# Altium schematic sheet EEPROM.SchDoc: =DocumentName
size A4; CompanyName: "AS Manufacturing" LLC; Organization: "AS Manufacturing" LLC; Address1: 5 Sklyarenka St.; Address2: Kyiv 04073; Address3: Ukraine; Address4: https://ajax.systems/en/; SheetNumber: 3; SheetTotal: 5; Template_version: 1.0.1
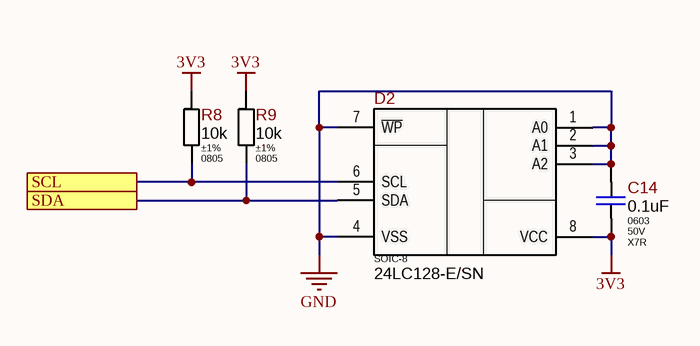
[diagram p0: EEPROM.SchDoc]

## Parts
C14  Package: 0603  Voltage: 50V  Dielectric Type: X7R  [C_CERAMIC_0603_MED]  (hidden comment: 0.1uF)
D2  Package: SOIC-8  [SOIC-8_W3.9MM]  (hidden comment: 24LC128-E/SN)
R8  Tolerance: ±1%  Package: 0805  [R_ANY_CHIP_0805_MED]  (hidden comment: 10k)
R9  Tolerance: ±1%  Package: 0805  [R_ANY_CHIP_0805_MED]  (hidden comment: 10k)

## Ports
SCL, SDA

## Nets
3V3: C14.1 D2.8(VCC) R8.2 R9.2
GND: C14.2 D2.1(A0) D2.2(A1) D2.3(A2) D2.4(VSS) D2.7(~{WP})
SCL: D2.6(SCL) R8.1 ; port SCL
SDA: D2.5(SDA) R9.1 ; port SDA

## Notes on the sheet
- Title
- Product:
- Project:
- Size:
- Date:
- Variant:
- A4
- Authors:
- Time:
- Sheet
- of
- Revision:
- @Vitech_ua
- Commit:

## Library data of the parts
C14 = CL10B104KB8NNND: 100nF 50V X7R ±10% 0603 Ceramic Capacitor RoHS; Manufacturer: Samsung Electro-Mechanics; Ajax_1C_ID: 21313; Ajax_1C_PN: 100nF 50V X7R 10% 0603 CL10B104KB8NNND ceramic capacitor SMD; Ajax_1С_Status: Substitution; Standard Lead Time: 18 Weeks; Component Status: Released; Replacement: CL10B104KB8NNNC; GUID_1C: f1fd6399-ca68-11ea-ab63-0050569f2651; Value: 0.1uF; Part Number: CL10B104KB8NNND; Part Type: Ceramic / X7R / 0603; Component Type: SMD; Temperature Range: -55°C ~ 125°C; Tolerance: ±10%; ComponentLink1URL: https://media.digikey.com/pdf/Data%20Sheets/Samsung%20PDFs/CL_Series_MLCC_ds.pdf; Supplier 1: Digi-Key; Supplier Part Number 1: CL10B104KB8NNND-ND; Price: 0,0039378; ComponentLink1Description: Datasheet
D2 = 24LC128-E/SN: EEPROM Memory IC 128Kb (16K x 8), I2C, 400kHz, 900ns, SOIC-8; Manufacturer: Microchip Technology; Ajax_1C_ID: 10590; Ajax_1C_PN: 24LC128-E/SN SO8; Ajax_1С_Status: RND Only; Standard Lead Time: 6 Weeks; Component Status: On Review; Replacement: NONE; GUID_1C: 19c1e12f-7c36-11e7-813c-14dda9d2d04d; Part Type: Memory / EEPROM; Component Type: SMD; Temperature Range: -40°C ~ 125°C; ComponentLink1URL: http://www.microchip.com/mymicrochip/filehandler.aspx?ddocname=en011851; Supplier 1: Mouser; Supplier Part Number 1: 579-24LC128-E/SN; Price: 0,83; ComponentLink1Description: Datasheet; Part Number: 24LC128-E/SN
R8 R9 = RC0805FR-0710K2L: 10 kOhms ±1%, 1/8W 0805 Thick Film Resistor; Manufacturer: Yageo; Ajax_1C_ID: 13943; Ajax_1C_PN: 10.2k 1% 0805 Resistors SMD RoHS; Ajax_1С_Status: Mass Production; Power Rating: 0.125W; Voltage: 150V; Component Status: Released; Temperature Stability: ±100ppm/°C; Replacement: NONE; GUID_1C: 8bc9d0ce-c58a-11e8-ab47-0050569f2651; Value: 10k; Part Number: RC0805FR-0710K2L; Component Type: SMD; Part Type: Thick Film; Temperature Range: -55°C ~ 155°C; ComponentLink1URL: https://eu.mouser.com/datasheet/2/447/PYu_RC_Group_51_RoHS_L_10-1664068.pdf; Supplier 1: Digi-Key; Supplier Part Number 1: 311-10.2KCRTR-ND; Price: 0,0014; ComponentLink1Description: Datasheet